# EAGLE design MB (EAGLE 7.2.0)
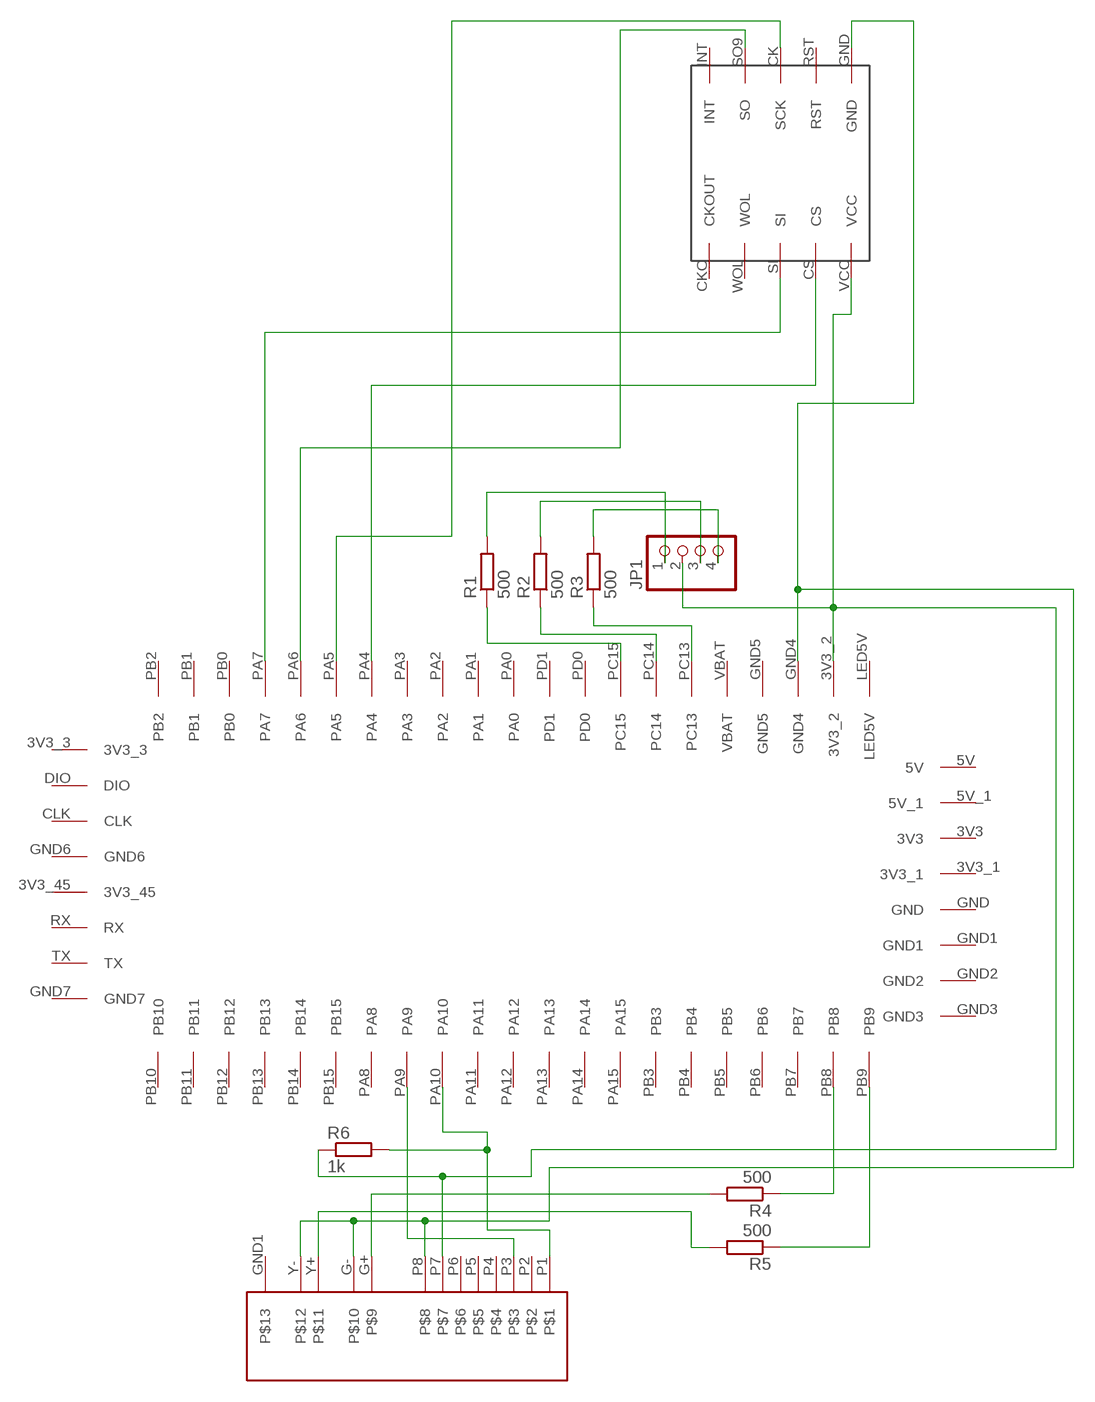
[diagram p0: schematic, sheet 1]

## Parts
JP1  PINHD-1X4  [1X04]
R1  500  R-EU_M1206  [M1206]
R2  500  R-EU_M1206  [M1206]
R3  500  R-EU_M1206  [M1206]
R4  500  R-EU_M1206  [M1206]
R5  500  R-EU_M1206  [M1206]
R6  1k  R-EU_M1206  [M1206]
U$1  F100X_SYSBOARD  [F10X_SYSBOARD]
U$2  SPI_ETHERNET  [SPI_ETHERNET]
U$3  RJ-45_LEDS  [RJ-45_LEDS]

## Nets
N$1: U$1.PA4 U$2.CS
N$2: U$1.PA6 U$2.SO9(SO)
N$3: U$1.PA7 U$2.SI
N$4: U$1.PA5 U$2.CK(SCK)
N$5: JP1.2 R6.1 U$1.3V3_2 U$2.VCC U$3.P7
N$6: U$1.GND4 U$2.GND U$3.G- U$3.P8 U$3.Y-
N$7: JP1.4 R3.2
N$8: JP1.3 R2.2
N$9: JP1.1 R1.2
N$10: R3.1 U$1.PC13
N$11: R2.1 U$1.PC14
N$12: R1.1 U$1.PC15
N$13: U$1.PA9 U$3.P3
N$14: R6.2 U$1.PA10 U$3.P1
N$16: R4.1 U$1.PB8
N$17: R4.2 U$3.G+
N$18: R5.1 U$1.PB9
N$19: R5.2 U$3.Y+
Unconnected: U$1.3V3_3 U$1.3V3_45 U$1.CLK U$1.DIO U$1.GND2 U$1.GND3 U$1.GND6 U$1.GND7 U$1.PA0 U$1.PA1 U$1.PA2 U$1.PA3 U$1.PA8 U$1.PA11 U$1.PA12 U$1.PA13 U$1.PA14 U$1.PA15 U$1.PB0 U$1.PB1 U$1.PB2 U$1.PB3 U$1.PB4 U$1.PB5 U$1.PB6 U$1.PB7 U$1.PB10 U$1.PB11 U$1.PB12 U$1.PB13 U$1.PB14 U$1.PB15 U$1.PD0 U$1.PD1 U$1.RX U$1.TX U$2.CKO(CKOUT) U$2.INT U$2.RST U$2.WOL U$3.P2 U$3.P4 U$3.P5 U$3.P6

## Power pins joined to a net without a drawn wire
3V3: U$1.3V3
3V3_1: U$1.3V3_1
5V: U$1.5V
5V_1: U$1.5V_1
GND: U$1.GND
GND1: U$1.GND1
GND5: U$1.GND5
LED5V: U$1.LED5V
P$13: U$3.GND1
VBAT: U$1.VBAT

## Library data of the parts
JP1 = pinhead:PINHD-1X4: PIN HEADER
R1-R6 = rcl:R-EU_: RESISTOR, European symbol
U$1 = UT_Board:F100X_SYSBOARD: STM32F10x system board
U$2 = UT_Board:SPI_ETHERNET
U$3 = con-pc:RJ-45_LEDS: RJ-45 connector with 2 leds

## Board
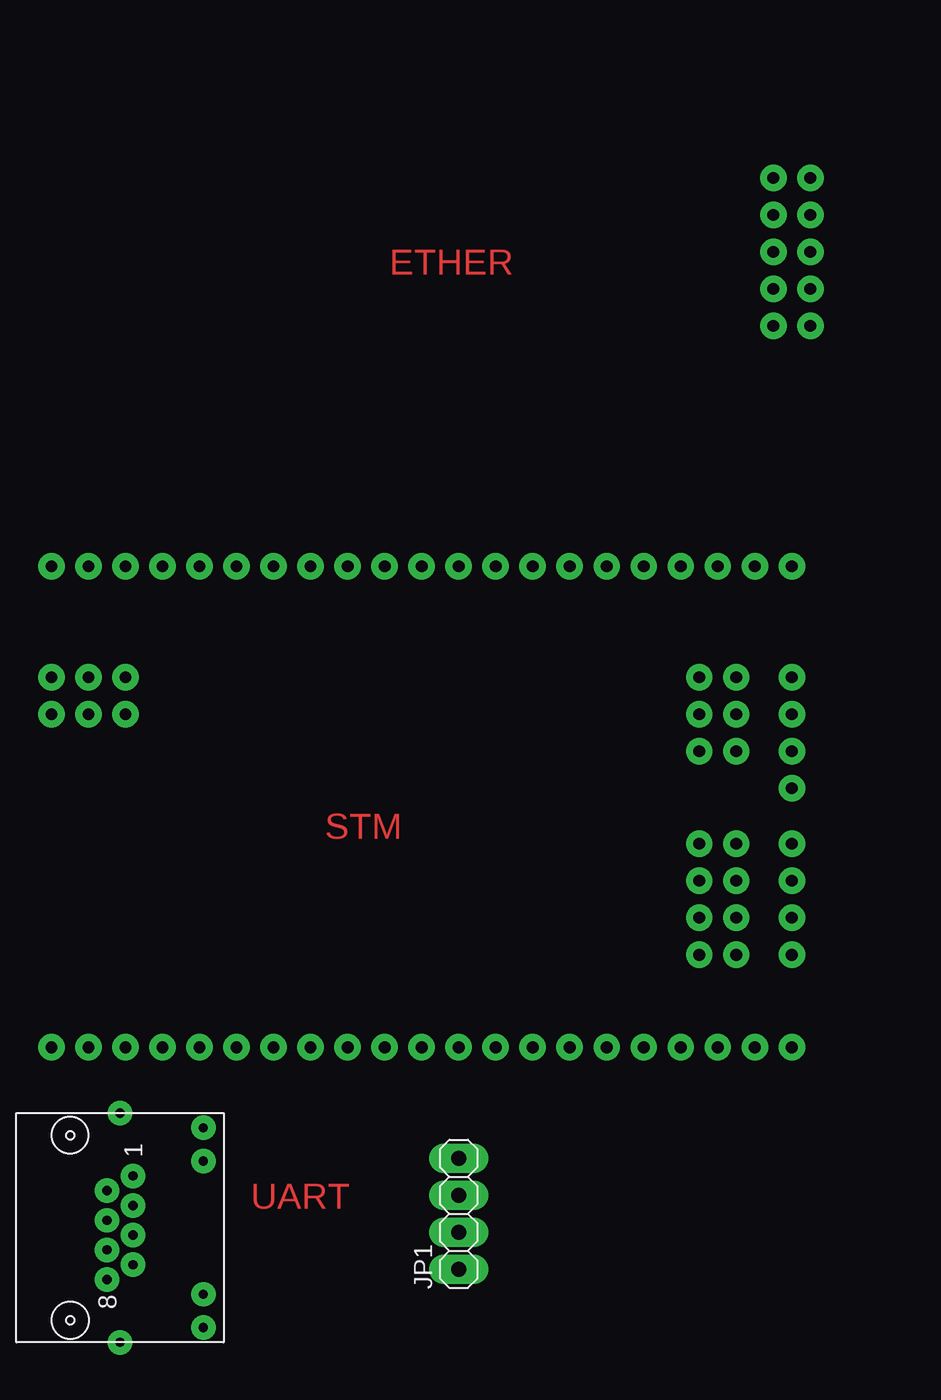
[diagram p1: board, top side]
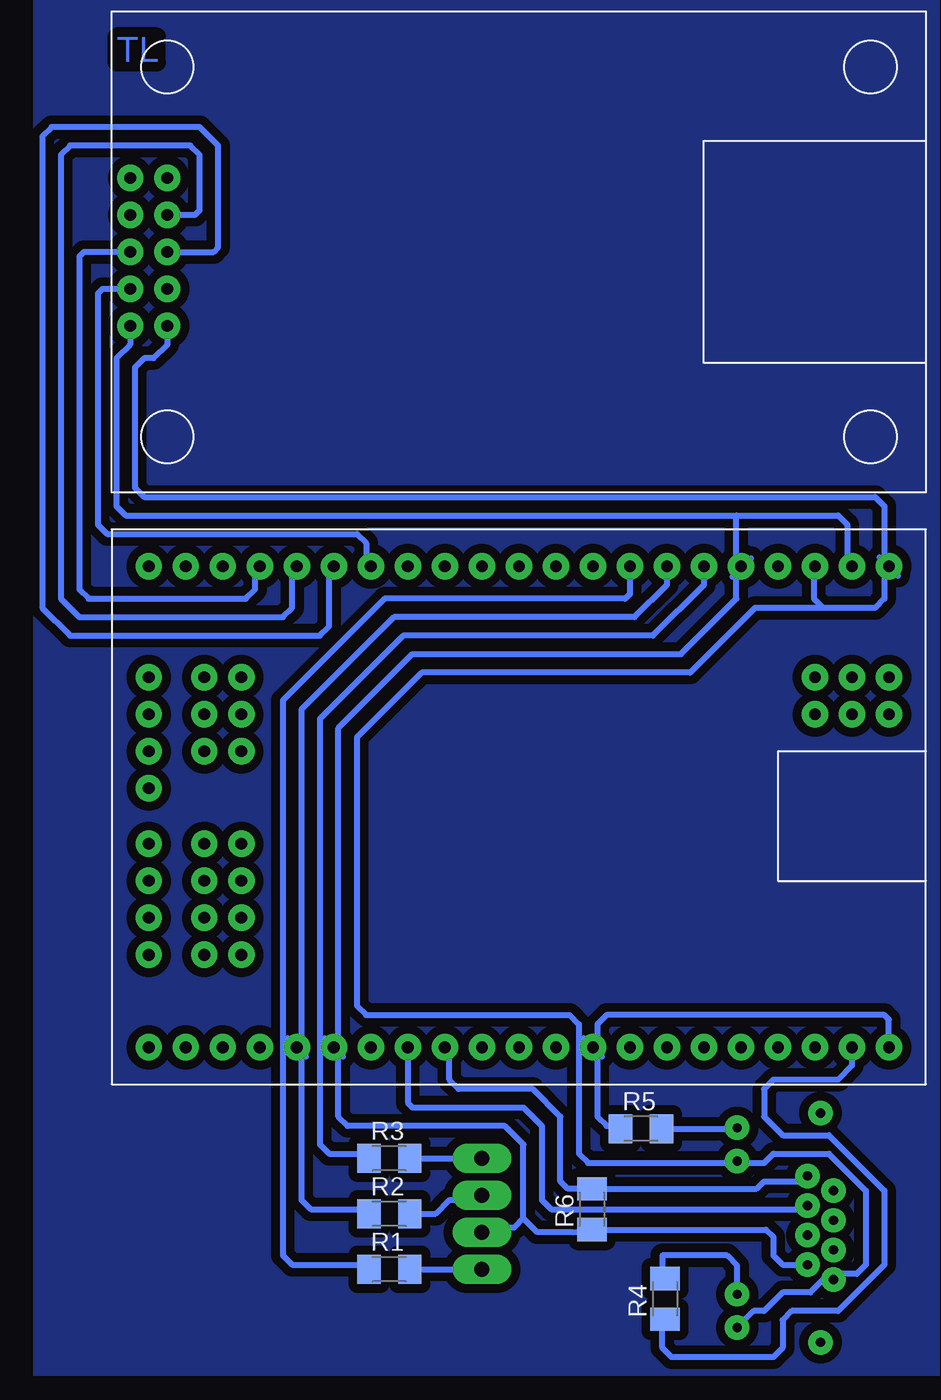
[diagram p2: board, bottom side, seen from below]

No outline drawn. Coordinates in mm, seen from the top.
Copper layers (1*16): Top 0.035mm / dielectric 1.5mm / Bottom 0.035mm
Design rules "default *": minimum track width 10mil, minimum drill 24mil, track to track 8mil, track to pad 8mil, pad to pad 8mil, via to via 8mil, smd to smd 8mil, copper to edge 40mil, drill to drill 8mil, minimum pad ring 20mil, minimum via ring 8mil, stop-mask expansion 4mil, vias tented up to drill 0mil, thermal gap 10mil

### Footprints (pad centres in the part's own frame; a part is rotated, then mirrored left to right if it is on the bottom)
1X04 = drill 1.016 long: 1 -3.81,0; 2 -1.27,0; 3 1.27,0; 4 3.81,0
M1206 = smd 1.6 x 2: 1 -1.4,0; 2 1.4,0
F10X_SYSBOARD = drill 0.8 pad 1.778: 3V3 -34.29,19.05; 3V3_1 -34.29,21.59; 3V3_2 10.16,40.64; 3V3_3 -38.1,13.97; 3V3_45 -38.1,25.4; 5V -34.29,13.97; 5V_1 -34.29,16.51; CLK -38.1,19.05; DIO -38.1,16.51; GND -31.75,13.97; GND1 -31.75,16.51; GND2 -31.75,19.05; GND3 -31.75,21.59; GND4 7.62,40.64; GND5 5.08,40.64; GND6 -38.1,21.59; GND7 -38.1,33.02; LED5V 12.7,40.64; P$51 -34.29,33.02; P$52 -34.29,30.48; P$53 -34.29,27.94; P$54 -31.75,33.02; P$55 -31.75,30.48; P$56 -31.75,27.94; P$65 12.7,33.02; P$66 10.16,33.02; P$67 7.62,33.02; P$68 7.62,30.48; P$69 10.16,30.48; P$70 12.7,30.48; PA0 -12.7,40.64; PA1 -15.24,40.64; PA2 -17.78,40.64; PA3 -20.32,40.64; PA4 -22.86,40.64; PA5 -25.4,40.64; PA6 -27.94,40.64; PA7 -30.48,40.64; PA8 -22.86,7.62; PA9 -20.32,7.62; PA10 -17.78,7.62; PA11 -15.24,7.62; PA12 -12.7,7.62; PA13 -10.16,7.62; PA14 -7.62,7.62; PA15 -5.08,7.62; PB0 -33.02,40.64; PB1 -35.56,40.64; PB2 -38.1,40.64; PB3 -2.54,7.62; PB4 0,7.62; PB5 2.54,7.62; PB6 5.08,7.62; PB7 7.62,7.62; PB8 10.16,7.62; PB9 12.7,7.62; PB10 -38.1,7.62; PB11 -35.56,7.62; PB12 -33.02,7.62; PB13 -30.48,7.62; PB14 -27.94,7.62; PB15 -25.4,7.62; PC13 0,40.64; PC14 -2.54,40.64; PC15 -5.08,40.64; PD0 -7.62,40.64; PD1 -10.16,40.64; RX -38.1,27.94; TX -38.1,30.48; VBAT 2.54,40.64
SPI_ETHERNET = drill 0.8 pad 1.778: CK 52.07,16.51; CKO 54.61,11.43; CS 54.61,19.05; GND 52.07,21.59; INT 52.07,11.43; RST 52.07,19.05; SI 54.61,16.51; SO9 52.07,13.97; VCC 54.61,21.59; WOL 54.61,13.97
RJ-45_LEDS = drill 0.635 pad 1.676: G+ -9.525,4.826; G- -9.525,7.112; GND -3.81,-7.62; GND1 -3.81,8.128; P1 -4.699,-3.302; P2 -2.921,-2.286; P3 -4.699,-1.27; P4 -2.921,-0.254; P5 -4.699,0.762; P6 -2.921,1.778; P7 -4.699,2.794; P8 -2.921,3.81; Y+ -9.525,-6.604; Y- -9.525,-4.318

### Placement (x,y rotation side)
JP1  31.43,11.11 90 top
R1  37.78,7.3 0 bottom
R2  37.78,11.11 0 bottom
R3  37.78,14.92 0 bottom
R4  18.86,5.27 90 bottom
R5  20.51,16.95 0 bottom
R6  23.88,11.43 90 bottom
U$1  16.19,14.92 0 bottom
U$2  0.95,93.66 180 bottom
U$3  4.38,10.41 180 top

### Tracks (layer width: path | path; a pad name or v marks a point on that pad's centre or on a via)
N$1
  Bottom 0.406: U$2.CS 57.47,74.61 57.78,74.3 57.78,58.42 57.15,57.78 40.01,57.78 39.37,57.15 39.37,55.88 U$1.PA4
N$2
  Bottom 0.406: U$2.SO9 51.12,79.69 50.8,80.01 50.8,83.82 51.44,84.45 59.69,84.45 60.33,83.82 60.33,53.34 59.05,52.07 45.09,52.07 44.45,52.7 44.45,55.24 U$1.PA6
N$3
  Bottom 0.406: U$2.SI 58.74,77.15 59.05,76.83 59.05,53.98 58.42,53.34 47.62,53.34 46.99,53.98 46.99,55.24 U$1.PA7
N$4
  Bottom 0.406: U$2.CK 49.85,77.15 49.53,77.47 49.53,84.45 50.8,85.72 60.96,85.72 61.59,85.09 61.59,52.7 59.69,50.8 42.55,50.8 41.91,51.44 41.91,55.24 U$1.PA5
N$5
  Bottom 0.406: U$2.VCC 55.56,70.8 56.52,69.85 56.52,59.69 55.88,59.05 13.97,59.05 | 13.97,59.05 6.99,59.05 6.35,58.42 6.35,55.88 U$1.3V3_2 | 28.57,10.79 27.62,9.84 25.21,9.84 R6.1 11.94,10.03 11.43,9.53 11.43,8.26 10.79,7.62 U$3.P7 | 28.57,10.79 28.57,15.88 29.84,17.14 40.64,17.14 41.27,17.78 41.27,44.45 36.2,49.53 17.78,49.53 13.97,53.34 13.97,59.05 | 28.57,10.79 29.21,10.16 31.11,10.16 JP1.2
N$6
  Bottom 0.406: U$1.GND4 8.64,55.5 8.64,53.34 8,52.7 | U$2.GND 53.02,70.8 53.98,69.85 54.61,69.85 55.24,69.22 55.24,60.96 54.61,60.33 4.45,60.33 3.81,59.69 3.81,53.34 4.45,52.7 8,52.7 | 8,52.7 12.7,52.7 17.14,48.26 35.56,48.26 40.01,43.81 40.01,25.4 39.37,24.77 25.4,24.77 24.77,24.13 24.77,15.24 24.13,14.61 14.03,14.61 | 14.03,14.61 U$3.Y- | 14.03,14.61 12.06,14.61 11.43,15.24 7.62,15.24 5.08,12.7 5.08,7.62 5.71,6.99 6.92,6.99 U$3.P8 8,6.6 8.89,5.71 10.79,5.71 12.06,4.45 12.76,4.45 U$3.G-
N$7
  Bottom 0.406: R3.2 JP1.4
N$8
  Bottom 0.406: R2.2 34.61,11.11 33.66,12.06 31.75,12.06 JP1.3
N$9
  Bottom 0.406: R1.2 JP1.1
N$10
  Bottom 0.406: U$1.PC13 16.19,54.29 19.68,50.8 36.83,50.8 42.55,45.09 42.55,15.88 41.91,15.24 39.5,15.24 R3.1
N$11
  Bottom 0.406: U$1.PC14 18.73,54.29 20.95,52.07 37.47,52.07 43.81,45.72 43.81,12.06 43.18,11.43 39.5,11.43 R2.1
N$12
  Bottom 0.406: U$1.PC15 21.27,53.66 21.59,53.34 38.1,53.34 45.09,46.35 45.09,8.26 44.45,7.62 39.5,7.62 R1.1
N$13
  Bottom 0.406: U$1.PA9 36.51,18.73 36.2,18.41 28.57,18.41 27.3,17.14 27.3,12.06 26.67,11.43 9.34,11.43 U$3.P3
N$14
  Bottom 0.406: U$1.PA10 33.66,22.23 33.66,20.32 33.02,19.68 27.94,19.68 26.04,17.78 26.04,13.34 25.53,12.83 R6.2 12.57,12.83 12.06,13.34 9.46,13.34 U$3.P1
N$15
  Bottom 0.406: 12.95,56.13 14.22,54.86
N$16
  Bottom 0.406: U$1.PB8 6.03,21.27 6.99,20.32 11.43,20.32 12.06,19.68 12.06,17.78 10.79,16.51 7.62,16.51 3.81,12.7 3.81,7.62 6.99,4.45 10.16,4.45 10.79,3.81 10.79,1.91 11.43,1.27 18.41,1.27 19.05,1.91 19.05,3.68 R4.1
N$17
  Bottom 0.406: U$3.G+ 13.91,7.56 14.61,8.26 19.05,8.26 19.05,6.86 R4.2
N$18
  Bottom 0.406: 21.84,16.95 R5.1 22.1,17.14 22.86,17.14 23.5,17.78 23.5,24.13 22.86,24.77 3.81,24.77 3.49,24.45 U$1.PB9
N$19
  Bottom 0.406: 19.11,17.02 R5.2 13.97,16.95 U$3.Y+
N$20
  Bottom 0.406: 4.13,56.2 2.86,54.93
N$21
  pour Bottom (isolate 0.61): 0,0 0,94.61 56.52,94.61 62.23,94.61 62.23,10.16 62.23,0
N$23
  Bottom 0.406: 42.23,23.18 40.96,21.91
N$24
  Bottom 0.406: 44.77,23.18 43.5,21.91
N$25
  Bottom 0.406: 24.45,23.18 23.18,21.91

### Text on the board
Top: ETHER | STM | UART
Bottom: TL